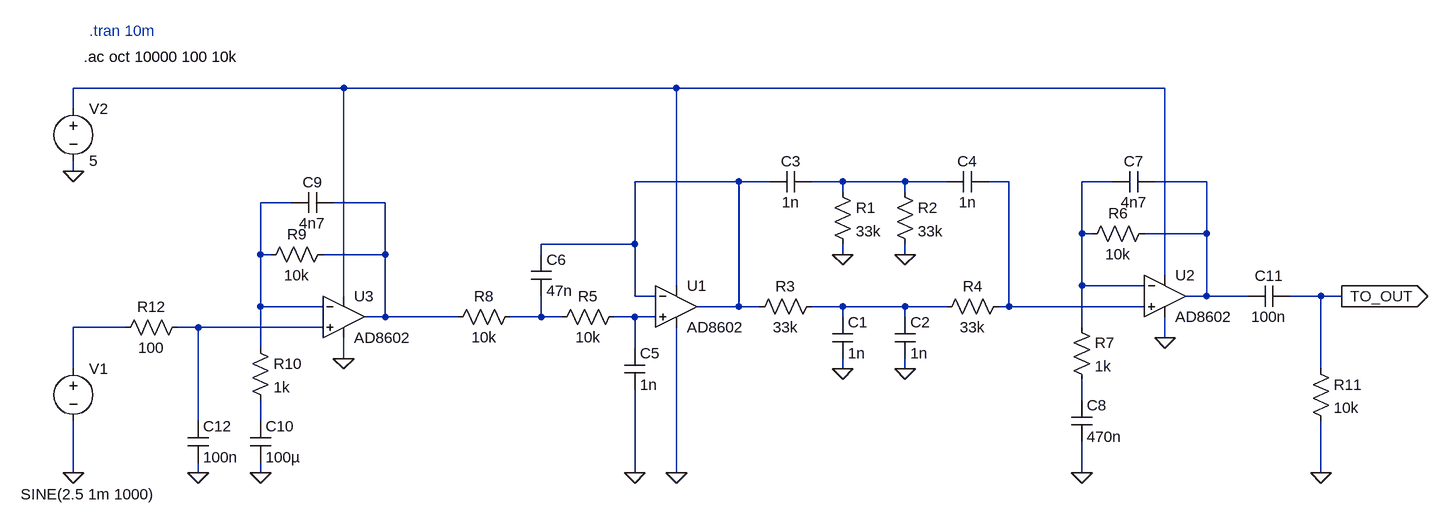
[diagram p0: schematic 4020 SSB Filter 1.asc]
4020 SSB Filter 1.asc, the LTspice schematic file:
Version 4
SHEET 1 1076 680
WIRE -1104 -192 -1520 -192
WIRE -592 -192 -1104 -192
WIRE 160 -192 -592 -192
WIRE -1520 -160 -1520 -192
WIRE -1520 -64 -1520 -80
WIRE -496 -48 -656 -48
WIRE -448 -48 -496 -48
WIRE -336 -48 -384 -48
WIRE -240 -48 -336 -48
WIRE -176 -48 -240 -48
WIRE -80 -48 -112 -48
WIRE 80 -48 32 -48
WIRE 224 -48 144 -48
WIRE -336 -32 -336 -48
WIRE -240 -32 -240 -48
WIRE -1184 -16 -1232 -16
WIRE -1040 -16 -1120 -16
WIRE 32 32 32 -48
WIRE 48 32 32 32
WIRE 224 32 224 -48
WIRE 224 32 128 32
WIRE -656 48 -656 -48
WIRE -656 48 -800 48
WIRE -1232 64 -1232 -16
WIRE -1216 64 -1232 64
WIRE -1040 64 -1040 -16
WIRE -1040 64 -1136 64
WIRE -800 64 -800 48
WIRE -336 64 -336 48
WIRE -240 64 -240 48
WIRE 160 96 160 -192
WIRE -592 112 -592 -192
WIRE 32 112 32 32
WIRE 128 112 32 112
WIRE -1104 128 -1104 -192
WIRE -656 128 -656 48
WIRE -624 128 -656 128
WIRE 224 128 224 32
WIRE 224 128 192 128
WIRE 288 128 224 128
WIRE 400 128 352 128
WIRE 432 128 400 128
WIRE -1232 144 -1232 64
WIRE -1136 144 -1232 144
WIRE -496 144 -496 -48
WIRE -496 144 -560 144
WIRE -464 144 -496 144
WIRE -336 144 -384 144
WIRE -240 144 -336 144
WIRE -176 144 -240 144
WIRE -80 144 -80 -48
WIRE -80 144 -96 144
WIRE 128 144 -80 144
WIRE -1040 160 -1040 64
WIRE -1040 160 -1072 160
WIRE -928 160 -1040 160
WIRE -800 160 -800 128
WIRE -800 160 -848 160
WIRE -768 160 -800 160
WIRE -656 160 -688 160
WIRE -624 160 -656 160
WIRE -336 160 -336 144
WIRE -240 160 -240 144
WIRE -1440 176 -1520 176
WIRE -1328 176 -1360 176
WIRE -1136 176 -1328 176
WIRE 32 176 32 112
WIRE 160 192 160 160
WIRE -1232 208 -1232 144
WIRE -656 208 -656 160
WIRE -1104 224 -1104 192
WIRE -1520 240 -1520 176
WIRE -336 240 -336 224
WIRE -240 240 -240 224
WIRE 400 240 400 128
WIRE 32 288 32 256
WIRE -1328 320 -1328 176
WIRE -1232 320 -1232 288
WIRE -1520 400 -1520 320
WIRE -1328 400 -1328 384
WIRE -1232 400 -1232 384
WIRE -656 400 -656 272
WIRE -592 400 -592 176
WIRE 32 400 32 352
WIRE 400 400 400 320
FLAG -336 64 0
FLAG -336 240 0
FLAG -1520 400 0
FLAG -240 64 0
FLAG -240 240 0
FLAG 432 128 TO_OUT
IOPIN 432 128 Out
FLAG -1520 -64 0
FLAG -656 400 0
FLAG -592 400 0
FLAG -1104 224 0
FLAG -1232 400 0
FLAG 160 192 0
FLAG 32 400 0
FLAG 400 400 0
FLAG -1328 400 0
SYMBOL cap -352 160 R0
SYMATTR InstName C1
SYMATTR Value 1n
SYMBOL cap -256 160 R0
SYMATTR InstName C2
SYMATTR Value 1n
SYMBOL res -352 -48 R0
SYMATTR InstName R1
SYMATTR Value 33k
SYMBOL res -256 -48 R0
SYMATTR InstName R2
SYMATTR Value 33k
SYMBOL cap -448 -64 M90
WINDOW 0 0 32 VBottom 2
WINDOW 3 32 32 VTop 2
SYMATTR InstName C3
SYMATTR Value 1n
SYMBOL cap -176 -64 M90
WINDOW 0 0 32 VBottom 2
WINDOW 3 32 32 VTop 2
SYMATTR InstName C4
SYMATTR Value 1n
SYMBOL res -368 128 R90
WINDOW 0 0 56 VBottom 2
WINDOW 3 32 56 VTop 2
SYMATTR InstName R3
SYMATTR Value 33k
SYMBOL res -80 128 R90
WINDOW 0 0 56 VBottom 2
WINDOW 3 32 56 VTop 2
SYMATTR InstName R4
SYMATTR Value 33k
SYMBOL voltage -1520 224 R0
WINDOW 39 24 124 Left 2
WINDOW 3 -81 209 Left 2
SYMATTR Value SINE(2.5 1m 1000)
SYMATTR Value2 AC 1
SYMATTR InstName V1
SYMBOL Opamps\\AD8602 -592 80 R0
SYMATTR InstName U1
SYMBOL res -672 144 R90
WINDOW 0 0 56 VBottom 2
WINDOW 3 32 56 VTop 2
SYMATTR InstName R5
SYMATTR Value 10k
SYMBOL cap -672 208 R0
SYMATTR InstName C5
SYMATTR Value 1n
SYMBOL voltage -1520 -176 R0
WINDOW 39 24 124 Left 2
SYMATTR InstName V2
SYMATTR Value 5
SYMBOL cap -816 64 R0
SYMATTR InstName C6
SYMATTR Value 47n
SYMBOL res -832 144 R90
WINDOW 0 0 56 VBottom 2
WINDOW 3 32 56 VTop 2
SYMATTR InstName R8
SYMATTR Value 10k
SYMBOL res -1232 80 R270
WINDOW 0 32 56 VTop 2
WINDOW 3 0 56 VBottom 2
SYMATTR InstName R9
SYMATTR Value 10k
SYMBOL cap -1120 -32 R90
WINDOW 0 0 32 VBottom 2
WINDOW 3 32 32 VTop 2
SYMATTR InstName C9
SYMATTR Value 4n7
SYMBOL Opamps\\AD8602 -1104 96 R0
SYMATTR InstName U3
SYMBOL res -1248 192 R0
SYMATTR InstName R10
SYMATTR Value 1k
SYMBOL cap -1248 320 R0
SYMATTR InstName C10
SYMATTR Value 100µ
SYMBOL res 32 48 R270
WINDOW 0 32 56 VTop 2
WINDOW 3 0 56 VBottom 2
SYMATTR InstName R6
SYMATTR Value 10k
SYMBOL cap 144 -64 R90
WINDOW 0 0 32 VBottom 2
WINDOW 3 32 32 VTop 2
SYMATTR InstName C7
SYMATTR Value 4n7
SYMBOL Opamps\\AD8602 160 64 R0
SYMATTR InstName U2
SYMBOL res 16 160 R0
SYMATTR InstName R7
SYMATTR Value 1k
SYMBOL cap 16 288 R0
SYMATTR InstName C8
SYMATTR Value 470n
SYMBOL res 384 224 R0
SYMATTR InstName R11
SYMATTR Value 10k
SYMBOL cap 352 112 R90
WINDOW 0 0 32 VBottom 2
WINDOW 3 32 32 VTop 2
SYMATTR InstName C11
SYMATTR Value 100n
SYMBOL res -1344 160 R90
WINDOW 0 0 56 VBottom 2
WINDOW 3 32 56 VTop 2
SYMATTR InstName R12
SYMATTR Value 100
SYMBOL cap -1344 320 R0
SYMATTR InstName C12
SYMATTR Value 100n
TEXT -1504 -240 Left 2 !.ac oct 10000 100 10k
TEXT -1496 -280 Left 2 ;.tran 10m

The netlist it stands for:
* 4020 SSB Filter 1.asc
C1 N009 0 1n
C2 N009 0 1n
R1 N003 0 33k
R2 N003 0 33k
C3 N002 N003 1n
C4 N003 N004 1n
R3 N009 N002 33k
R4 N004 N009 33k
V1 N012 0 SINE(2.5 1m 1000) AC 1
XU1 N011 N002 N001 0 N002 AD8602  ; pins In+ In- V+ V- OUT
R5 N011 N010 10k
C5 N011 0 1n
V2 N001 0 5
C6 N002 N010 47n
R8 N010 N008 10k
R9 N007 N008 10k
C9 N008 N007 4n7
XU3 N013 N007 N001 0 N008 AD8602  ; pins In+ In- V+ V- OUT
R10 N007 N015 1k
C10 N015 0 100µ
R6 N005 N006 10k
C7 N006 N005 4n7
XU2 N004 N005 N001 0 N006 AD8602  ; pins In+ In- V+ V- OUT
R7 N005 N014 1k
C8 N014 0 470n
R11 TO_OUT 0 10k
C11 TO_OUT N006 100n
R12 N013 N012 100
C12 N013 0 100n
.ac oct 10000 100 10k
* .tran 10m
.backanno
.end